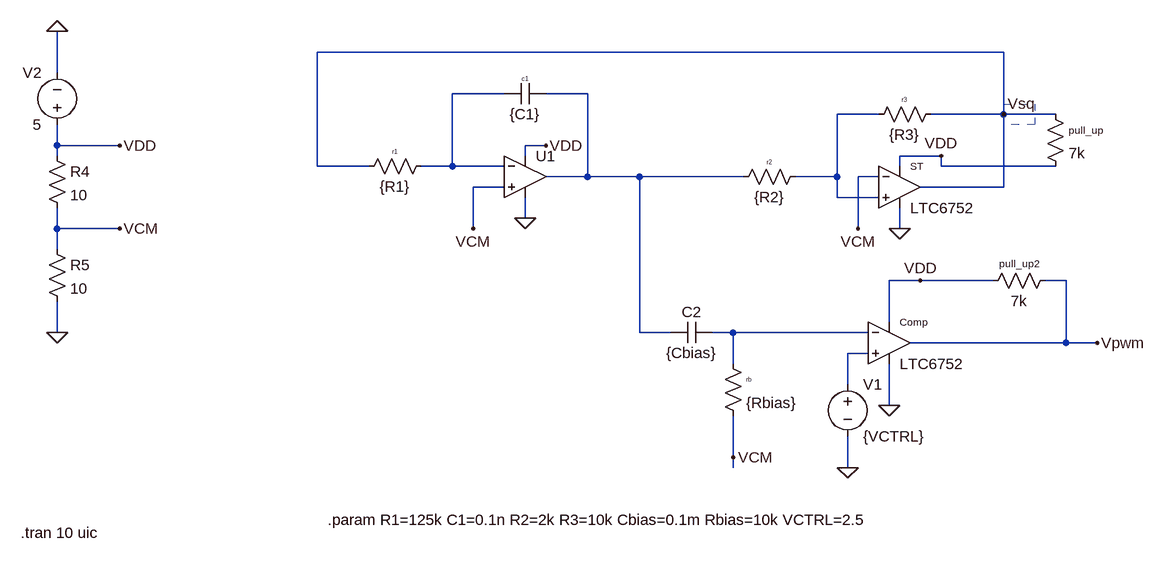
[diagram p0: schematic Sch1.asc]
Sch1.asc, the LTspice schematic file:
Version 4
SHEET 1 1956 1060
WIRE 672 -400 -384 -400
WIRE -784 -368 -784 -432
WIRE -96 -336 -176 -336
WIRE 32 -336 -32 -336
WIRE 480 -304 416 -304
WIRE 672 -304 672 -400
WIRE 672 -304 560 -304
WIRE 752 -304 672 -304
WIRE -784 -256 -784 -288
WIRE -688 -256 -784 -256
WIRE -32 -256 -64 -256
WIRE -784 -240 -784 -256
WIRE -64 -240 -64 -256
WIRE 576 -240 512 -240
WIRE -384 -224 -384 -400
WIRE -304 -224 -384 -224
WIRE -176 -224 -176 -336
WIRE -176 -224 -224 -224
WIRE -96 -224 -176 -224
WIRE 512 -224 512 -240
WIRE 576 -224 576 -240
WIRE 752 -224 576 -224
WIRE 32 -208 32 -336
WIRE 32 -208 -32 -208
WIRE 112 -208 32 -208
WIRE 272 -208 112 -208
WIRE 416 -208 416 -304
WIRE 416 -208 352 -208
WIRE 480 -208 448 -208
WIRE -96 -192 -144 -192
WIRE 672 -192 672 -304
WIRE 672 -192 544 -192
WIRE 416 -176 416 -208
WIRE 480 -176 416 -176
WIRE -64 -144 -64 -176
WIRE -784 -128 -784 -160
WIRE -688 -128 -784 -128
WIRE -144 -128 -144 -192
WIRE 448 -128 448 -208
WIRE 512 -128 512 -160
WIRE -784 -96 -784 -128
WIRE 544 -48 496 -48
WIRE 656 -48 544 -48
WIRE 768 -48 736 -48
WIRE 496 16 496 -48
WIRE -784 32 -784 -16
WIRE 112 32 112 -208
WIRE 160 32 112 32
WIRE 256 32 224 32
WIRE 464 32 256 32
WIRE 768 48 768 -48
WIRE 768 48 528 48
WIRE 816 48 768 48
WIRE 464 64 432 64
WIRE 256 80 256 32
WIRE 432 112 432 64
WIRE 496 144 496 80
WIRE 256 224 256 160
WIRE 256 240 256 224
WIRE 432 240 432 192
FLAG 432 240 0
FLAG 496 144 0
FLAG 816 48 Vpwm
FLAG 672 -304 Vsq
FLAG -784 32 0
FLAG -784 -432 0
FLAG -688 -256 VDD
FLAG -688 -128 VCM
FLAG -144 -128 VCM
FLAG 448 -128 VCM
FLAG -32 -256 VDD
FLAG 576 -240 VDD
FLAG -64 -144 0
FLAG 512 -128 0
FLAG 544 -48 VDD
FLAG 256 224 VCM
SYMBOL Comparators\\LTC6752 512 -256 R0
WINDOW 0 16 32 Left 1
SYMATTR InstName ST
SYMBOL res 576 -320 R90
WINDOW 0 0 56 VBottom 0
WINDOW 3 32 56 VTop 2
SYMATTR InstName r3
SYMATTR Value {R3}
SYMBOL res 368 -224 R90
WINDOW 0 0 56 VBottom 0
WINDOW 3 32 56 VTop 2
SYMATTR InstName r2
SYMATTR Value {R2}
SYMBOL res -208 -240 R90
WINDOW 0 0 56 VBottom 0
WINDOW 3 32 56 VTop 2
SYMATTR InstName r1
SYMATTR Value {R1}
SYMBOL cap -32 -352 R90
WINDOW 0 0 32 VBottom 0
WINDOW 3 32 32 VTop 2
SYMATTR InstName c1
SYMATTR Value {C1}
SYMBOL Comparators\\LTC6752 496 -16 R0
WINDOW 0 16 32 Left 1
SYMATTR InstName Comp
SYMBOL res 240 64 R0
WINDOW 0 36 40 Left 0
SYMATTR InstName rb
SYMATTR Value {Rbias}
SYMBOL voltage 432 96 R0
SYMATTR InstName V1
SYMATTR Value {VCTRL}
SYMBOL res -800 -256 R0
SYMATTR InstName R4
SYMATTR Value 10
SYMBOL res -800 -112 R0
SYMATTR InstName R5
SYMATTR Value 10
SYMBOL voltage -784 -272 R180
WINDOW 0 24 96 Left 2
WINDOW 3 24 16 Left 2
SYMATTR InstName V2
SYMATTR Value 5
SYMBOL res 752 -64 R90
WINDOW 0 0 56 VBottom 1
WINDOW 3 32 56 VTop 2
SYMATTR InstName pull_up2
SYMATTR Value 7k
SYMBOL res 736 -320 R0
WINDOW 0 36 40 Left 1
SYMATTR InstName pull_up
SYMATTR Value 7k
SYMBOL OpAmps\\UniversalOpAmp -64 -208 R0
SYMATTR InstName U1
SYMBOL cap 224 16 R90
WINDOW 0 0 32 VBottom 2
WINDOW 3 32 32 VTop 2
SYMATTR InstName C2
SYMATTR Value {Cbias}
TEXT -368 320 Left 2 !.param R1=125k C1=0.1n R2=2k R3=10k Cbias=0.1m Rbias=10k VCTRL=2.5
TEXT -840 340 Left 2 !.tran 10 uic
RECTANGLE Normal 720 -288 672 -320 2

The netlist it stands for:
* Sch1.asc
XST N003 VCM VDD 0 Vsq LTC6752  ; pins In+ In- V+ V- OUT
r3 Vsq N003 {R3}
r2 N003 N002 {R2}
r1 N001 Vsq {R1}
c1 N002 N001 {C1}
XComp N005 N004 VDD 0 Vpwm LTC6752  ; pins In+ In- V+ V- OUT
rb N004 VCM {Rbias}
V1 N005 0 {VCTRL}
R4 VDD VCM 10
R5 VCM 0 10
V2 VDD 0 5
R§pull_up2 Vpwm VDD 7k
R§pull_up Vsq VDD 7k
XU1 VCM N001 VDD 0 N002 level1 Avol=1Meg GBW=10Meg Vos=0 En=0 Enk=0 In=0 Ink=0 Rin=500Meg  ; pins In+ In- V+ V- OUT
C2 N004 N002 {Cbias}
.param R1=125k C1=0.1n R2=2k R3=10k Cbias=0.1m Rbias=10k VCTRL=2.5
.tran 10 uic
.lib LTC7.lib
.lib UniversalOpAmp1.lib
.backanno
.end